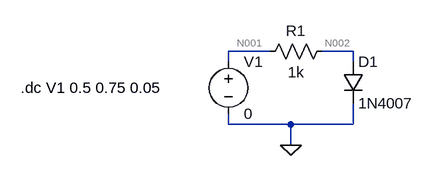
[diagram p0: schematic DIODE_FORWARD.asc]
DIODE_FORWARD.asc, the LTspice schematic file:
Version 4.1
SHEET 1 880 680
WIRE 96 96 32 96
WIRE 224 96 176 96
WIRE 32 112 32 96
WIRE 224 112 224 96
WIRE 32 208 32 192
WIRE 128 208 32 208
WIRE 224 208 224 176
WIRE 224 208 128 208
WIRE 128 240 128 208
FLAG 128 240 0
SYMBOL voltage 32 96 R0
SYMATTR InstName V1
SYMATTR Value 0
SYMBOL diode 208 112 R0
SYMATTR InstName D1
SYMATTR Value 1N4007
SYMBOL res 192 80 R90
WINDOW 0 0 56 VBottom 2
WINDOW 3 32 56 VTop 2
SYMATTR InstName R1
SYMATTR Value 1k
TEXT -288 152 Left 2 !.dc V1 0.5 0.75 0.05

The netlist it stands for:
* DIODE_FORWARD.asc
V1 N001 0 0
D1 N002 0 1N4007
R1 N002 N001 1k
.model D D
.lib standard.dio
.dc V1 0.5 0.75 0.05
.backanno
.end

* Results of the author's LTspice run, read from the files saved beside the schematic
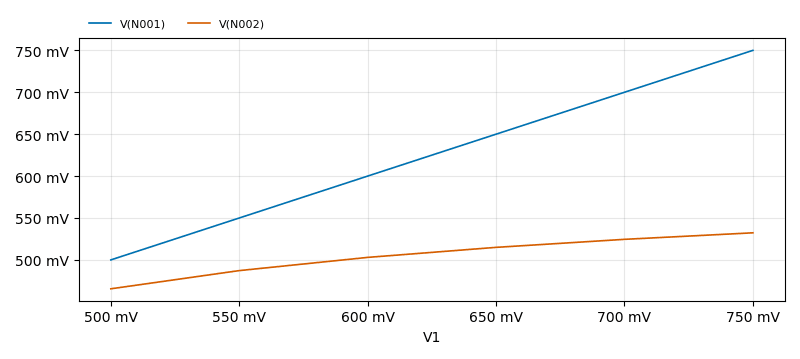
[diagram p1: DC transfer characteristic of DIODE_FORWARD.asc, plotted from the saved traces]
* DC transfer characteristic, 1 run:
*   V(N001): 500 mV at V1=500 mV, 750 mV at V1=750 mV, min 500 mV, max 750 mV
*   V(N002): 465.5 mV at V1=500 mV, 532.3 mV at V1=750 mV, min 465.5 mV, max 532.3 mV